# Altium schematic sheet ADS1256.SchDoc
size A4
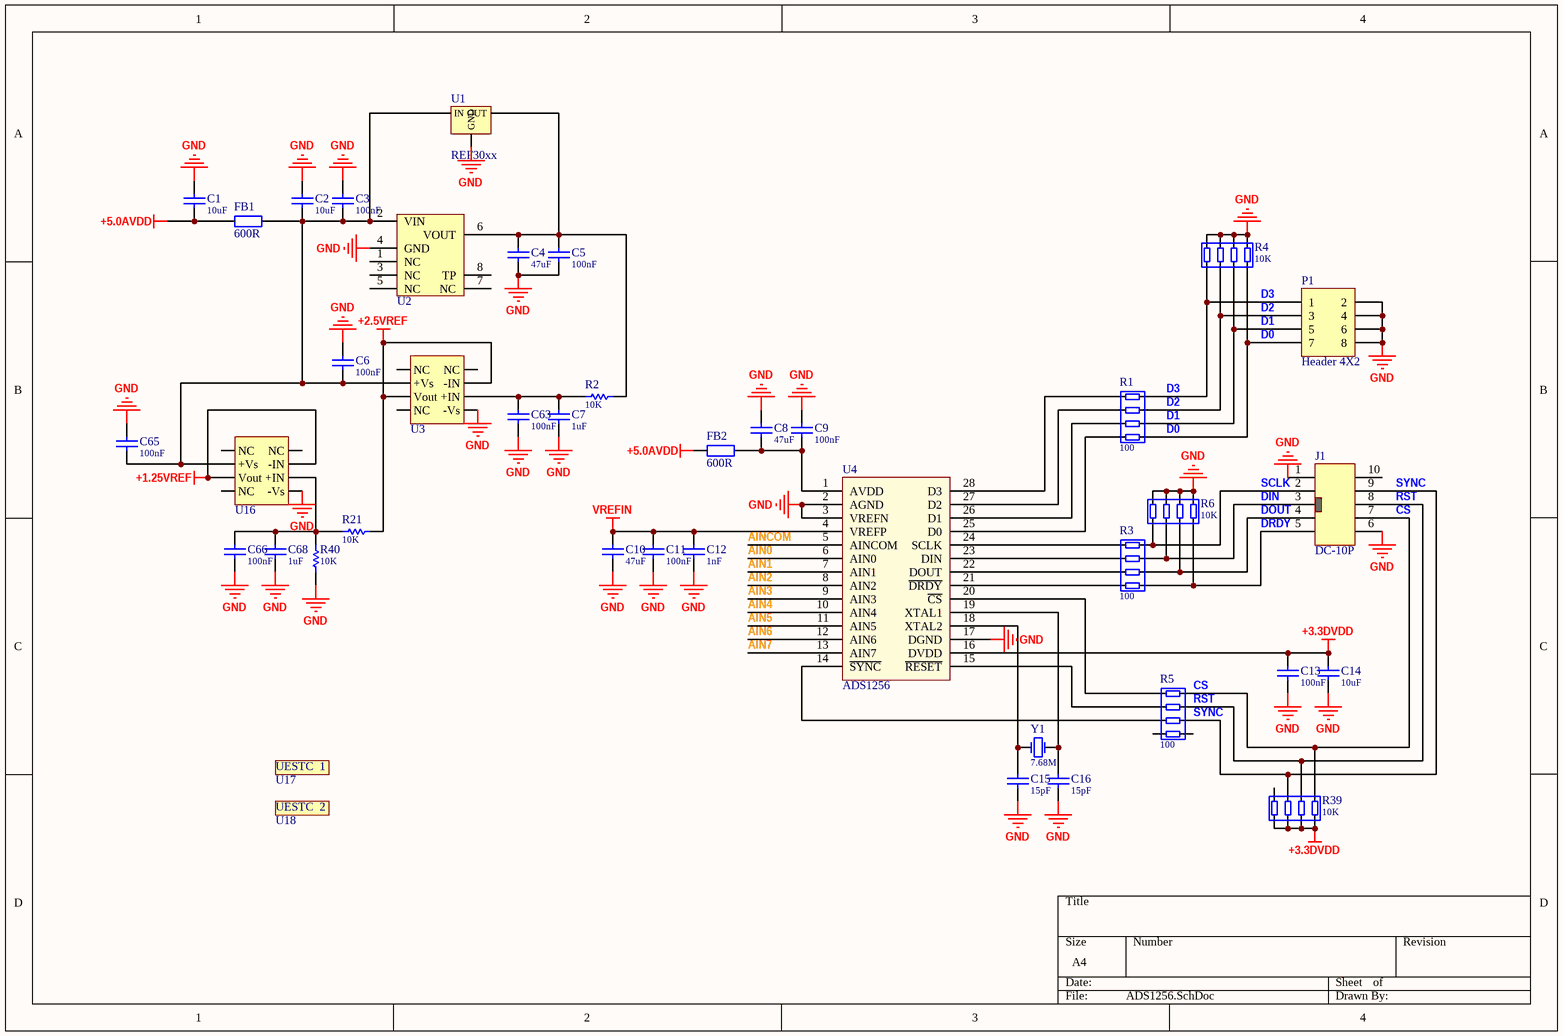
[diagram p0: ADS1256.SchDoc]

## Parts
C1  value 10uF  [C0603-L]  (hidden comment: Cap-S)
C2  value 10uF  [C0603-L]  (hidden comment: Cap-S)
C3  value 100nF  [C0402-L]  (hidden comment: Cap-S)
C4  value 47uF  [C0805-L]  (hidden comment: Cap-S)
C5  value 100nF  [C0402-L]  (hidden comment: Cap-S)
C6  value 100nF  [C0402-L]  (hidden comment: Cap-S)
C7  value 1uF  [C0603-L]  (hidden comment: Cap-S)
C8  value 47uF  [C0805-L]  (hidden comment: Cap-S)
C9  value 100nF  [C0402-L]  (hidden comment: Cap-S)
C10  value 47uF  [C0805-L]  (hidden comment: Cap-S)
C11  value 100nF  [C0402-L]  (hidden comment: Cap-S)
C12  value 1nF  [C0402-L]  (hidden comment: Cap-S)
C13  value 100nF  [C0402-L]  (hidden comment: Cap-S)
C14  value 10uF  [C0603-L]  (hidden comment: Cap-S)
C15  value 15pF  [C0603-L]  (hidden comment: Cap-S)
C16  value 15pF  [C0603-L]  (hidden comment: Cap-S)
C63  value 100nF  [C0402-L]  (hidden comment: Cap-S)
C65  value 100nF  [C0402-L]  (hidden comment: Cap-S)
C66  value 100nF  [C0402-L]  (hidden comment: Cap-S)
C68  value 1uF  [C0603-L]  (hidden comment: Cap-S)
FB1  600R  [FB-0805]
FB2  600R  [FB-0805]
J1  DC-10P  [DC-10P]
P1  Header 4X2  [HDR2X4]
R1  value 100  [R0603X4]  (hidden comment: R)
R2  value 10K  [R0603-L]  (hidden comment: R)
R3  value 100  [R0603X4]  (hidden comment: R)
R4  value 10K  [R0603X4]  (hidden comment: R)
R5  value 100  [R0603X4]  (hidden comment: R)
R6  value 10K  [R0603X4]  (hidden comment: R)
R21  value 10K  [R0603-L]  (hidden comment: R)
R39  value 10K  [R0603X4]  (hidden comment: R)
R40  value 10K  [R0603-L]  (hidden comment: R)
U1  REF30xx  [SOT23-3_L]
U2  ADR45xx  [SOIC-8_N]  (value not drawn)
U3  OPA657  [SOIC-8_N]  (value not drawn)
U4  ADS1256  [TSSOP-28]
U16  OPA657  [SOIC-8_N]  (value not drawn)
U17  UESTC  1  [UESTC]  (value not drawn)
U18  UESTC  2  [UESTC  2]  (value not drawn)
Y1  value 7.68M  [XTAL-PB2-SMD]  (hidden comment: XTAL)

## Nets
+1.25VREF: U16.2(-IN) U16.6(Vout)
+2.5VREF: R21.2 U3.2(-IN) U3.6(Vout)
+3.3DVDD: C13.2 C14.2 R39.1 R39.2 R39.3 R39.4 U4.16(DVDD)
+5.0AVDD: C1.1 FB1.1 FB2.1
GND: C1.2 C2.2 C3.1 C4.1 C5.1 C6.1 C7.1 C8.2 C9.1 C10.2 C11.1 C12.1 C13.1 C14.1 C15.2 C16.2 C63.1 C65.1 C66.1 C68.1 J1.1 J1.6 P1.2 P1.4 P1.6 P1.8 R4.5 R4.6 R4.7 R4.8 R6.5 R6.6 R6.7 R6.8 R40.1 U1.3(GND) U2.4(GND) U3.4(-Vs) U4.2(AGND) U4.3(VREFN) U4.17(DGND) U16.4(-Vs)
VREFIN: C10.1 C11.2 C12.2 U4.4(VREFP)
AIN0: U4.6(AIN0)
AIN1: U4.7(AIN1)
AIN2: U4.8(AIN2)
AIN3: U4.9(AIN3)
AIN4: U4.10(AIN4)
AIN5: U4.11(AIN5)
AIN6: U4.12(AIN6)
AIN7: U4.13(AIN7)
AINCOM: U4.5(AINCOM)
CS: J1.7 R5.8 R39.8
D0: P1.7 R1.5 R4.1
D1: P1.5 R1.6 R4.2
D2: P1.3 R1.7 R4.3
D3: P1.1 R1.8 R4.4
DIN: J1.3 R3.7 R6.3
DOUT: J1.4 R3.6 R6.2
DRDY: J1.5 R3.5 R6.1
RST: J1.8 R5.7 R39.7
SCLK: J1.2 R3.8 R6.4
SYNC: J1.9 R5.6 R39.6
NetC2_1: C2.1 C3.2 C6.2 C65.2 FB1.2 U1.1(IN) U2.2(VIN) U3.7(+Vs) U16.7(+Vs)
NetC4_2: C4.2 C5.2 R2.2 U1.2(OUT) U2.6(VOUT)
NetC7_2: C7.2 C63.2 R2.1 U3.3(+IN)
NetC8_1: C8.1 C9.2 FB2.2 U4.1(AVDD)
NetC15_1: C15.1 U4.18(XTAL2) Y1.2(OSC2)
NetC16_1: C16.1 U4.19(XTAL1) Y1.1(OSC1)
NetC66_2: C66.2 C68.2 R21.1 R40.2 U16.3(+IN)
NetR1_1: R1.1 U4.28(D3)
NetR1_2: R1.2 U4.27(D2)
NetR1_3: R1.3 U4.26(D1)
NetR1_4: R1.4 U4.25(D0)
NetR3_1: R3.1 U4.24(SCLK)
NetR3_2: R3.2 U4.23(DIN)
NetR3_3: R3.3 U4.22(DOUT)
NetR3_4: R3.4 U4.21(~{DRDY})
NetR5_1: R5.1 U4.20(~{CS})
NetR5_2: R5.2 U4.15(~{RESET})
NetR5_3: R5.3 U4.14(~{SYNC})

Not connected (* = marked no-connect by the designer): J1 10; R5 4 5; R39 5; U2 1(NC) 3(NC) 5(NC) 7(NC) 8(TP); U3 1(NC) 5(NC) 8(NC); U16 1(NC) 5(NC) 8(NC)

## Library data of the parts
C1-C16 C63 C65 C66 C68 = Cap-S: 贴片瓷片电容
FB1 FB2 = FB
P1 = Header 4X2: Header, 4-Pin, Dual row; LatestRevisionDate: 17-Jul-2002; LatestRevisionNote: Re-released for DXP Platform.; Publisher: Altium Limited
R1 R3-R6 R39 = Res-4R: 排阻 4
R2 R21 R40 = Res: 贴片电阻
U1 = REF3025: 采用 SOT23-3 封装的 2.5V 输出 50ppm/℃ 漂移 50uA 静态电流的（带隙）电压参考
U2 = ADR45xx: 超低噪声、高精度  基准电压源
U3 U16 = OPA657: 1.6-GHz, Low-Noise, FET-Input Operational Amplifier; Manufacturer: Texas Instruments; PartNumber: OPA656U; 2nd Harmonic(dBc): 74; 3rd Harmonic(dBc): 100; @ MHz: 5; Acl, min stable gain(V/V): 1; BW @ Acl(MHz): 500; Diff Gain(%): 0.02; Diff Phase(deg): 0.05; Eco-Plan: Green (RoHS & no Sb/Br); Io(Typ)(mA): 70; Iq per channel(Max)(mA): 16; Slew Rate(Typ)(V/us): 290; Sub Family: High Output Current Amplifier (>=50mA), High Speed Amplifier (>=50MHz), Low Input Bias Current Amp (<=10pA); THD (Fc is 1 MHz)(Typ)(dB): -74; Vio(Max)(mV): 0.6; Vn at Flatband(Typ)(nV/rtHz): 7; Vs(Max)(V): 12; Vs(Min)(V): 10; DatasheetVersion: SBOS196G; PackageVersion: 4040047-3/M, 06/2011; PackageReference: D8; PackageDescription: 8-Pin Plastic Small Outline, Body 4.9 x 3.9 mm, Pitch 1.27 mm; Supplier 1: Digi-Key; Supplier Part Number 1: OPA656U-ND; Supplier 2: Farnell; Supplier Part Number 2: 1212322; Supplier 3: Newark; Supplier Part Number 3: 75C5137; Supplier 4: Mouser; Supplier Part Number 4: 595-OPA656U; Iib(Max)(nA): 0.02; Number of Channels: 1; Settling Time (0.1%)(Typ)(ns): 16; Mounting Technology: Surface Mount; Code_JEDEC: MS-012; ComponentLink1Description: Manufacturer URL; ComponentLink1URL: http://www.ti.com/; ComponentLink2Description: Datasheet; ComponentLink2URL: http://www.ti.com/general/docs/lit/getliterature.tsp?genericPartNumber=OPA656&fileType=pdf; ComponentLink3Description: Package Specification; ComponentLink3URL: http://www.ti.com/litv/pdf/msoi002j
Y1 = XTAL: 晶振